# EAGLE schematic Ham-Dip-003 (EAGLE 8.2.1)
VCC: 5v
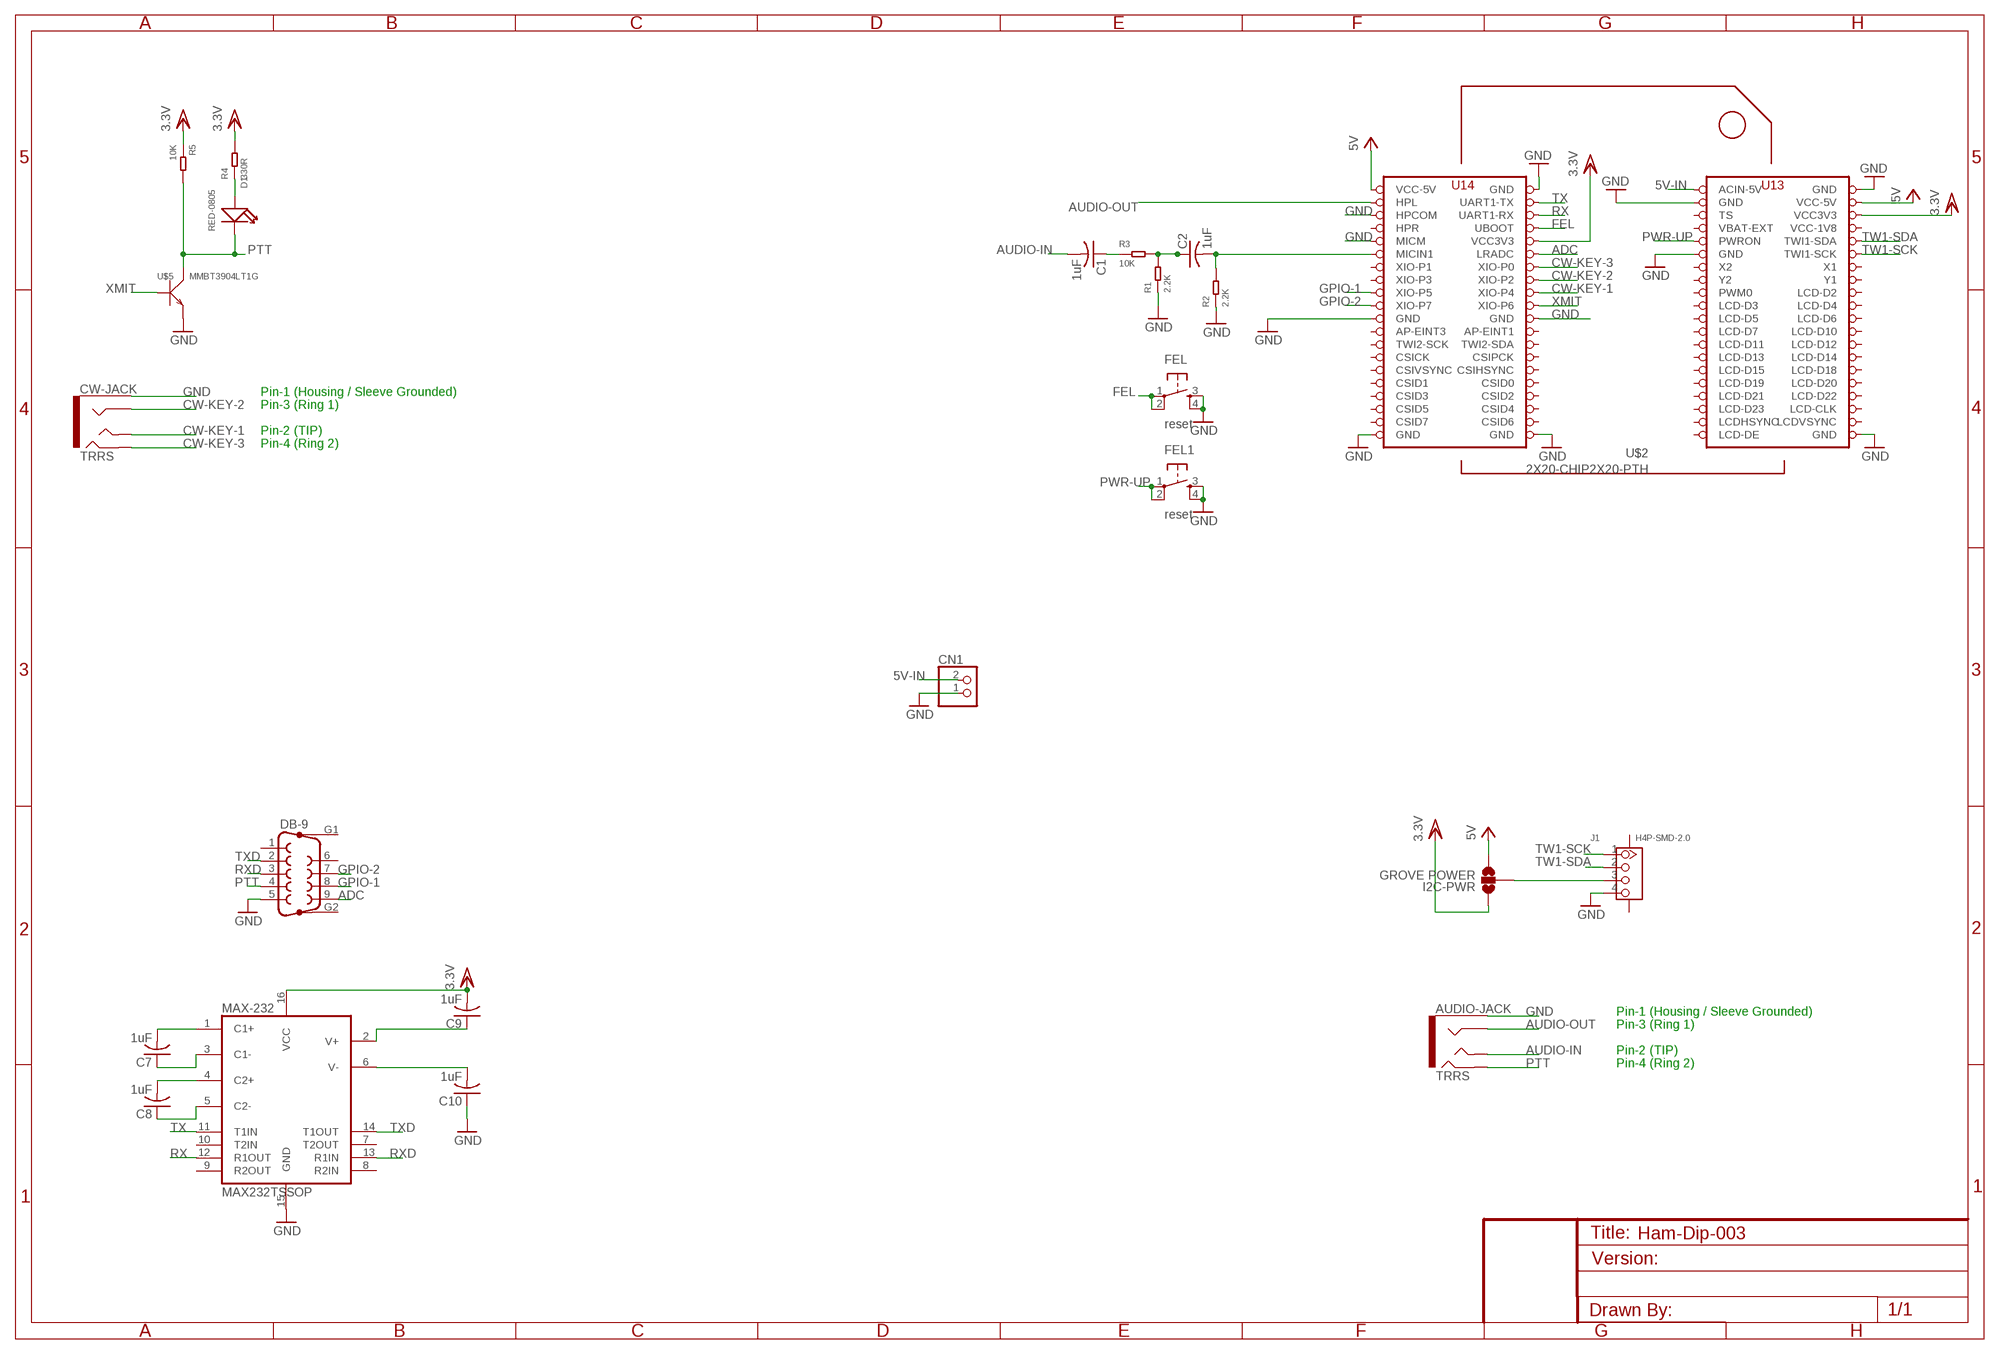
[diagram p0: schematic, sheet 1]

## Parts
AUDIO-JACK  TRRS  AUDIO-JACK3  [AUDIO-JACK-TRRS-SMD]
C1  1uF  C-USC0805  [C0805]
C2  1uF  C-USC0805  [C0805]
C7  1uF  C-USC0805  [C0805]
C8  1uF  C-USC0805  [C0805]
C9  1uF  C-USC0805  [C0805]
C10  1uF  C-USC0805  [C0805]
CN1  JST_2PIN-SMT  [JST-PH-2-SMT]
CW-JACK  TRRS  AUDIO-JACK3  [AUDIO-JACK-TRRS-SMD]
D1  RED-0805  SMD-LED-CLEAR-RED(0805)  [LED-0805]
DB-9  F09HP  [F09HP]
FEL  reset  TAC_SWITCHSMD  [TACTILE_SWITCH_SMD]
FEL1  reset  TAC_SWITCHSMD  [TACTILE_SWITCH_SMD]
I2C-PWR  GROVE POWER  SMD_SJ_3WAY_OPENT  [SMD_SJ_3WAY_OPEN]
J1  H4P-SMD-2.0  GROVE-CONNECTOR-SMD(4+2P-2.0)  [HW4-SMD-2.0]
MAX-232  MAX232TSSOP  [TSSOP16]
R1  2.2K  SMD-RES-2.2K-5%-1/8W(0805)  [R0805]
R2  2.2K  SMD-RES-2.2K-5%-1/8W(0805)  [R0805]
R3  10K  SMD-RES-10K-1%-1/8W(0805)  [R0805]
R4  330R  SMD-RES-220R-5%-1/8W(0805)  [R0805]
R5  10K  SMD-RES-10K-1%-1/8W(0805)  [R0805]
U$2  2X20-CHIP2X20-PTH  2X20-CHIP2X20-PTH-CHIP_A  [2X20CHIP-TH]
U$5  MMBT3904LT1G  SMD-TRANSISTORS-NPN-40V-200MA-MMBT3904LT1G(SOT-23)  [SOT-23]

## Nets
5V-IN: CN1.2 U$2.CHG-IN(ACIN-5V)
ADC: DB-9.9 U$2.LRADC
AUDIO-IN: AUDIO-JACK.TIP C1.2
AUDIO-OUT: AUDIO-JACK.RING1 U$2.HPL
CW-KEY-1: CW-JACK.TIP U$2.XIO-P4
CW-KEY-2: CW-JACK.RING1 U$2.XIO-P2
CW-KEY-3: CW-JACK.RING2 U$2.XIO-P0
FEL: FEL.1 FEL.2 U$2.FEL(UBOOT)
GND: AUDIO-JACK.EARTH C10.1 CN1.1 CW-JACK.EARTH DB-9.5 FEL1.3 FEL1.4 FEL.3 FEL.4 J1.4 MAX-232.15(GND) R1.1 R2.1 U$2.GND@1(GND) U$2.GND@2(GND) U$2.GND@3(GND) U$2.GND@4(GND) U$2.GND@5(GND) U$2.GND@6(GND) U$2.GND@7(GND) U$2.GND@8(GND) U$2.GND@10(GND) U$2.HPCOM U$2.MICM U$5.2(E)
GPIO-1: DB-9.8 U$2.XIO-P5
GPIO-2: DB-9.7 U$2.XIO-P7
MIC-IN: C2.2 R2.2 U$2.MICIN1
N$1: D1.+ R4.1
N$3: C1.1 R3.1
N$4: C2.1 R1.2 R3.2
N$5: I2C-PWR.2 J1.3
N$6: C9.1 MAX-232.2(V+)
N$11: C10.2 MAX-232.6(V-)
N$16: C7.2 MAX-232.1(C1+)
N$17: C8.2 MAX-232.4(C2+)
N$18: C7.1 MAX-232.3(C1-)
N$19: C8.1 MAX-232.5(C2-)
PTT: AUDIO-JACK.RING2 D1.- DB-9.4 R5.2 U$5.3(C)
PWR-UP: FEL1.1 FEL1.2 U$2.PWRON
RX: MAX-232.12(R1OUT) U$2.UART1-RX
RXD: DB-9.3 MAX-232.13(R1IN)
TW1-SCK: J1.1 U$2.TWI1-SCK
TW1-SDA: J1.2 U$2.TWI1-SDA
TX: MAX-232.11(T1IN) U$2.UART1-TX
TXD: DB-9.2 MAX-232.14(T1OUT)
VCC: I2C-PWR.3 U$2.VCC5V@0(VCC-5V) U$2.VCC5V@1(VCC-5V) ; supply symbol labelled 5V
VCC/2: C9.2 I2C-PWR.1 MAX-232.16(VCC) R4.2 R5.1 U$2.VCC3V3 U$2.VCC3V3@1(VCC3V3) ; supply symbol labelled 3.3V
XMIT: U$2.XIO-P6 U$5.1(B)
Unconnected: DB-9.1 DB-9.6 DB-9.G1 DB-9.G2 J1.SS1 J1.SS2 MAX-232.7(T2OUT) MAX-232.8(R2IN) MAX-232.9(R2OUT) MAX-232.10(T2IN) U$2.AP-EINT1 U$2.AP-EINT3 U$2.BAT(VBAT-EXT) U$2.CSICK U$2.CSID0 U$2.CSID1 U$2.CSID2 U$2.CSID3 U$2.CSID4 U$2.CSID5 U$2.CSID6 U$2.CSID7 U$2.CSIHSYNC U$2.CSIPCK U$2.CSIVSYNC U$2.HPR U$2.LCD-CLK U$2.LCD-D2 U$2.LCD-D3 U$2.LCD-D4 U$2.LCD-D5 U$2.LCD-D6 U$2.LCD-D7 U$2.LCD-D10 U$2.LCD-D11 U$2.LCD-D12 U$2.LCD-D13 U$2.LCD-D14 U$2.LCD-D15 U$2.LCD-D18 U$2.LCD-D19 U$2.LCD-D20 U$2.LCD-D21 U$2.LCD-D22 U$2.LCD-D23 U$2.LCD-DE U$2.LCD-HSYNC(LCDHSYNC) U$2.LCD-VSYNC(LCDVSYNC) U$2.PWM0 U$2.TS U$2.TWI2-SCK U$2.TWI2-SDA U$2.X1 U$2.X2 U$2.XIO-P1 U$2.XIO-P3 U$2.Y1 U$2.Y2

## Notes on the sheet
- Pin-1 (Housing / Sleeve Grounded)
- Pin-3 (Ring 1)
- Pin-2 (TIP)
- Pin-4 (Ring 2)
- Pin-1 (Housing / Sleeve Grounded)
- Pin-3 (Ring 1)
- Pin-2 (TIP)
- Pin-4 (Ring 2)

## Power pins joined to a net without a drawn wire
VCC-1V8: U$2.VCC1V8(VCC-1V8)

## Library data of the parts
AUDIO-JACK CW-JACK = SparkFun-Connectors:AUDIO-JACK3: Audio jack - 3.5mm TRRS variety - two rings.
C1 C2 C7-C10 = adafruit:C-US: CAPACITOR, American symbol
CN1 = adafruit:JST_2PIN: JST 2-Pin Connectors of various flavors SMT-RA (S2B-PH-SM4) 4UConnector #17311 SMT (B2B-PH-SM4) THM-RA (S2B-PH) THM (B2B-PH)
D1 = Seeed-LED-2016:SMD-LED-CLEAR-RED(0805): 304090046; MPN: 17-215SURC/S530-A2/TR8
DB-9 = con-subd:F09HP: SUB-D; OC_FARNELL: unknown; OC_NEWARK: unknown
FEL FEL1 = SparkFun-Electromechanical:TAC_SWITCH: Momentary Switch Button commonly used for reset or general input. Spark Fun Electronics SKU : COM-00097 SMT- SWCH-08247; PROD_ID: SWCH-08247
I2C-PWR = JKW_CHIP:SMD_SJ_3WAY_OPEN: Solder Jumper 2 way solder jumper
J1 = Seeed-Connector -2016:GROVE-CONNECTOR-SMD(4+2P-2.0): 320110030
MAX-232 = SparkFun-DigitalIC:MAX232: RS232 Transceiver Very common IC. This is generically called 'MAX232', but works with the 3V equivalent MAX3232 generic ICs. Field tested and mother approved. Spark Fun Electronics SKU : COM-00316 (DIP) and COM-00589 (SMD)
R1 R2 = Seeed-Resistor-2016:SMD-RES-2.2K-5%-1/8W(0805): 301010333; MPN: RC0805JR-072K2L
R3 R5 = Seeed-Resistor-2016:SMD-RES-10K-1%-1/8W(0805): 301010361; MPN: RC0805FR-0710KL
R4 = Seeed-Resistor-2016:SMD-RES-220R-5%-1/8W(0805): 301010315; MPN: RC0805JR-07220RL; VALUE: 220R
U$2 = JKW_CHIP:2X20-CHIP: Chip header; DESCRIPTION: 2x20 .100" headers; FOOTPRINT: 2x20 .100" CHIP foot print; VENDOR: ASSMANN; VENDOR_PART_NUMBER: AWHW40-G-SMD-R (single)
U$5 = Seeed-Transistor-2016:SMD-TRANSISTORS-NPN-40V-200MA-MMBT3904LT1G(SOT-23): 305010013; MPN: MMBT3904LT1G